# Altium schematic sheet Sensor.SchDoc
size A4
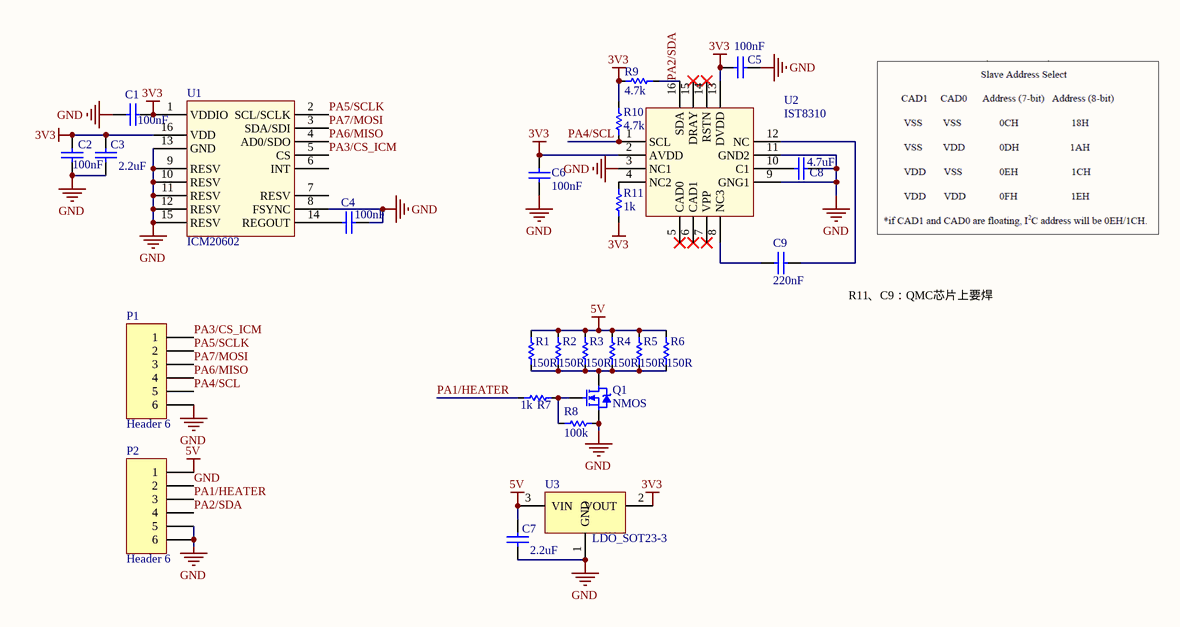
[diagram p0: Sensor.SchDoc]

## Parts
C1  100nF  [0402C]
C2  100nF  [0402C]
C3  2.2uF  [0402C]
C4  100nF  [0402C]
C5  100nF  [0402C]
C6  100nF  [0402C]
C7  2.2uF  [0402C]
C8  4.7uF  [0402C]
C9  220nF  [0402C]
P1  Header 6  [HEADER 6x1 _ 1.0mm]
P2  Header 6  [HEADER 6x1 _ 1.0mm]
Q1  NMOS  [SOT-23-3]
R1  150R  [0603R]
R2  150R  [0603R]
R3  150R  [0603R]
R4  150R  [0603R]
R5  150R  [0603R]
R6  150R  [0603R]
R7  1k  [0402R]
R8  100k  [0402R]
R9  4.7k  [0402R]
R10  4.7k  [0402R]
R11  1k  [0402R]
U1  ICM20602  [LGA-16]
U2  IST8310  [LGA16]
U3  LDO_SOT23-3  [SOT-23-3]

## Nets
3V3: C1.2 C2.2 C3.1 C5.2 C6.2 R9.2 R10.2 R11.1 U1.1(VDDIO) U1.16(VDD) U2.2(AVDD) U2.13(DVDD) U3.2(VOUT)
5V: C7.1 P2.1 R1.1 R2.1 R3.1 R4.2 R5.2 R6.2 U3.3(VIN)
GND: C1.1 C2.1 C3.2 C4.2 C5.1 C6.1 C7.2 C8.1 P1.6 P2.2 P2.5 P2.6 Q1.2(S) R8.2 U1.8(FSYNC) U1.9(RESV) U1.10(RESV) U1.11(RESV) U1.12(RESV) U1.13(GND) U1.15(RESV) U2.3(NC1) U2.9(GNG1) U2.11(GND2) U3.1(GND)
PA1/HEATER: P2.3 R7.1
PA2/SDA: P2.4 R9.1 U2.16(SDA)
PA3/CS_ICM: P1.1 U1.5(CS)
PA4/SCL: P1.5 R10.1 U2.1(SCL)
PA5/SCLK: P1.2 U1.2(SCL/SCLK)
PA6/MISO: P1.4 U1.4(AD0/SDO)
PA7/MOSI: P1.3 U1.3(SDA/SDI)
NetC4_1: C4.1 U1.14(REGOUT)
NetC8_2: C8.2 U2.10(C1)
NetC9_1: C9.1 U2.8(NC3)
NetC9_2: C9.2 U2.12(NC)
NetQ1_1: Q1.1(G) R7.2 R8.1
NetQ1_3: Q1.3(D) R1.2 R2.2 R3.2 R4.1 R5.1 R6.1
NetR11_2: R11.2 U2.4(NC2)

Not connected (* = marked no-connect by the designer): U1 6(INT) 7(RESV); U2 5(CAD0)* 6(CAD1)* 7(VPP)* 14(RSTN)* 15(DRAY)*

## Notes on the sheet
- R11、C9：QMC芯片上要焊

## Library data of the parts
C1-C9 = Cap: Capacitor; Value: 100pF; Published: 8-Jun-2000; LatestRevisionDate: 17-Jul-2002; LatestRevisionNote: Re-released for DXP Platform.; PackageReference: RAD-0.3; Publisher: Altium Limited; PackageDescription: Radial Cap, Thru-Hole; 2 Leads; 0.3 in Pin Spacing
P1 P2 = Header 6: Header, 5-Pin; LatestRevisionDate: 17-Jul-2002; LatestRevisionNote: Re-released for DXP Platform.; Publisher: Altium Limited
Q1 = NMOS(SOT23): N-Channel Power MOSFET; Note: Pin 2 is electrically connected to pin 4.; Published: 8-Jun-2000; LatestRevisionDate: 17-Jul-2002; LatestRevisionNote: Re-released for DXP Platform.; DatasheetVersion: PD-9.814; PackageVersion: Feb-1997; PackageReference: TO-220AB; Publisher: Altium Limited; PackageDescription: TO, Thru-Hole, Vertical, Heatsink Mounted; 3 In-Line Leads; Pitch 2.54 mm; ComponentLink1Description: Manufacturer Link; ComponentLink1URL: http://www.irf.com/
R1-R6 R8-R10 = Res1: Resistor; Value: 1K; Published: 8-Jun-2000; LatestRevisionDate: 17-Jul-2002; LatestRevisionNote: Re-released for DXP Platform.; PackageReference: AXIAL-0.3; Publisher: Altium Limited; PackageDescription: Axial Device, Thru-Hole; 2 Leads; 0.3 in Pin Spacing
R7 R11 = Res1: Resistor; Published: 8-Jun-2000; LatestRevisionDate: 17-Jul-2002; LatestRevisionNote: Re-released for DXP Platform.; PackageReference: AXIAL-0.3; Publisher: Altium Limited; PackageDescription: Axial Device, Thru-Hole; 2 Leads; 0.3 in Pin Spacing; Value: 1K